# EAGLE schematic SupergunBasic (EAGLE 9.4.0)
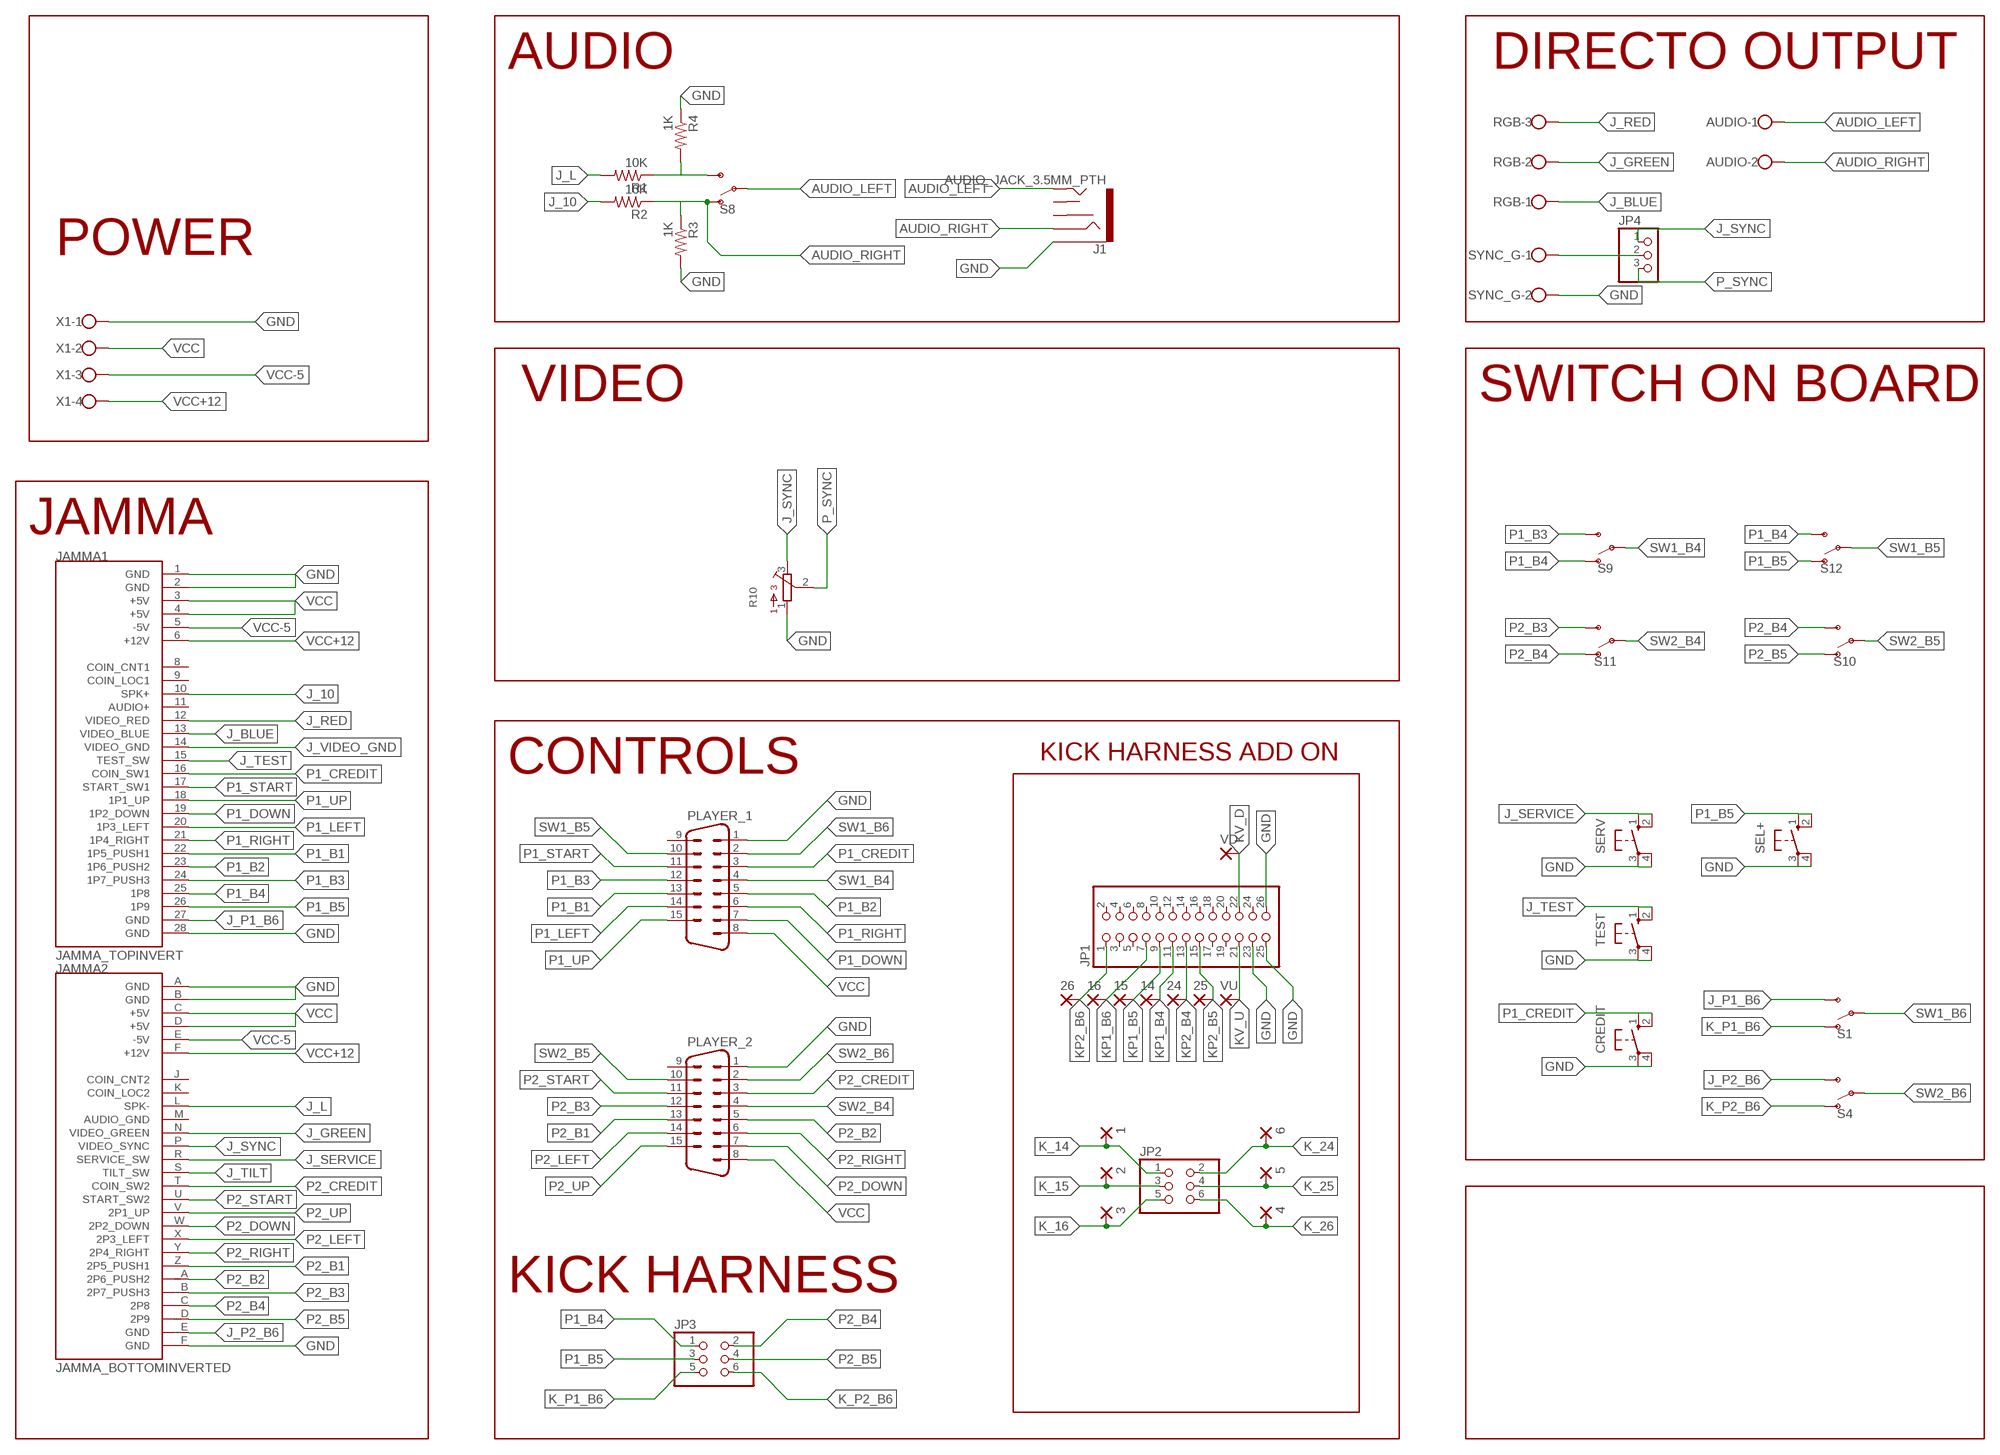
[diagram p0: schematic, sheet 1]

## Parts
1  SMD2  [SMD1,27-2,54]
2  SMD2  [SMD1,27-2,54]
3  SMD2  [SMD1,27-2,54]
4  SMD2  [SMD1,27-2,54]
5  SMD2  [SMD1,27-2,54]
6  SMD2  [SMD1,27-2,54]
14  SMD2  [SMD1,27-2,54]
15  SMD2  [SMD1,27-2,54]
16  SMD2  [SMD1,27-2,54]
24  SMD2  [SMD1,27-2,54]
25  SMD2  [SMD1,27-2,54]
26  SMD2  [SMD1,27-2,54]
AUDIO  W237-102  [W237-102]
CREDIT  10-XX  [B3F-10XX]
J1  AUDIO_JACK_3.5MM_PTH  [AUDIO-JACK]
JAMMA1  JAMMA_TOPINVERT  [JAMMA_TOP_INV]
JAMMA2  JAMMA_BOTTOMINVERTED  [JAMMA_BOTTOM_INV]
JP1  PINHD-2X13  [2X13]
JP2  PINHD-2X3  [2X03]
JP3  PINHD-2X3  [2X03]
JP4  PINHD-1X3  [1X03]
PLAYER_1  M15HP  [M15HP]
PLAYER_2  M15HP  [M15HP]
R1  10K  R-US_0204/7  [0204/7]
R2  10K  R-US_0204/7  [0204/7]
R3  1K  R-US_0204/7  [0204/7]
R4  1K  R-US_0204/7  [0204/7]
R10  3362P  [3362P]
RGB  W237-103  [W237-103]
S1  SWITCH-SPDT-PTH-11.6X4.0MM  [SWITCH_SPDT_PTH_11.6X4.0MM]
S4  SWITCH-SPDT-PTH-11.6X4.0MM  [SWITCH_SPDT_PTH_11.6X4.0MM]
S8  SWITCH-SPDT-PTH-11.6X4.0MM  [SWITCH_SPDT_PTH_11.6X4.0MM]
S9  SWITCH-SPDT-PTH-11.6X4.0MM  [SWITCH_SPDT_PTH_11.6X4.0MM]
S10  SWITCH-SPDT-PTH-11.6X4.0MM  [SWITCH_SPDT_PTH_11.6X4.0MM]
S11  SWITCH-SPDT-PTH-11.6X4.0MM  [SWITCH_SPDT_PTH_11.6X4.0MM]
S12  SWITCH-SPDT-PTH-11.6X4.0MM  [SWITCH_SPDT_PTH_11.6X4.0MM]
SEL+  10-XX  [B3F-10XX]
SERV  10-XX  [B3F-10XX]
SYNC_G  W237-102  [W237-102]
TEST  10-XX  [B3F-10XX]
VD  SMD2  [SMD1,27-2,54]
VU  SMD2  [SMD1,27-2,54]
X1  W237-4  [W237-4]

## Nets
AUDIO_LEFT: AUDIO.1 J1.TIP S8.2(P)
AUDIO_RIGHT: AUDIO.2 J1.RING R2.1 R3.1 S8.1(O)
DIRECT_SYNC: JP4.2 SYNC_G.1
GND [GND]: CREDIT.3(P) CREDIT.4(P1) J1.SLEEVE JAMMA1.1(GND) JAMMA1.2(GND) JAMMA1.28(GND) JAMMA2._F(GND) JAMMA2.A(GND) JAMMA2.B(GND) JP1.23 JP1.25 JP1.26 PLAYER_1.1 PLAYER_2.1 R3.2 R4.1 R10.1 SEL+.3(P) SEL+.4(P1) SERV.3(P) SERV.4(P1) SYNC_G.2 TEST.3(P) TEST.4(P1) X1.1
J_10: JAMMA1.10(SPK+) R2.2
J_BLUE: JAMMA1.13(VIDEO_BLUE) RGB.1
J_GREEN: JAMMA2.N(VIDEO_GREEN) RGB.2
J_L: JAMMA2.L(SPK-) R1.2
J_P1_B6: JAMMA1.27(GND) S1.3(S)
J_P2_B6: JAMMA2._E(GND) S4.3(S)
J_RED: JAMMA1.12(VIDEO_RED) RGB.3
J_SERVICE: JAMMA2.R(SERVICE_SW) SERV.1(S) SERV.2(S1)
J_SYNC: JAMMA2.P(VIDEO_SYNC) JP4.1 R10.3
J_TEST: JAMMA1.15(TEST_SW) TEST.1(S) TEST.2(S1)
J_TILT: JAMMA2.S(TILT_SW)
J_VIDEO_GND [GND]: JAMMA1.14(VIDEO_GND)
K_14: 1.1(P) JP2.1
K_15: 2.1(P) JP2.3
K_16: 3.1(P) JP2.5
K_24: 6.1(P) JP2.2
K_25: 5.1(P) JP2.4
K_26: 4.1(P) JP2.6
K_P1_B6: JP3.5 S1.1(O)
K_P2_B6: JP3.6 S4.1(O)
KP1_B4: 14.1(P) JP1.11
KP1_B5: 15.1(P) JP1.9
KP1_B6: 16.1(P) JP1.7
KP2_B4: 24.1(P) JP1.13
KP2_B5: 25.1(P) JP1.15
KP2_B6: 26.1(P) JP1.1
KV_D: JP1.22 VD.1(P)
KV_U: JP1.21 VU.1(P)
P1_B1: JAMMA1.22(1P5_PUSH1) PLAYER_1.13
P1_B2: JAMMA1.23(1P6_PUSH2) PLAYER_1.5
P1_B3: JAMMA1.24(1P7_PUSH3) PLAYER_1.12 S9.3(S)
P1_B4: JAMMA1.25(1P8) JP3.1 S9.1(O) S12.3(S)
P1_B5: JAMMA1.26(1P9) JP3.3 S12.1(O) SEL+.1(S) SEL+.2(S1)
P1_CREDIT: CREDIT.1(S) CREDIT.2(S1) JAMMA1.16(COIN_SW1) PLAYER_1.3
P1_DOWN: JAMMA1.19(1P2_DOWN) PLAYER_1.7
P1_LEFT: JAMMA1.20(1P3_LEFT) PLAYER_1.14
P1_RIGHT: JAMMA1.21(1P4_RIGHT) PLAYER_1.6
P1_START: JAMMA1.17(START_SW1) PLAYER_1.11
P1_UP: JAMMA1.18(1P1_UP) PLAYER_1.15
P2_B1: JAMMA2.Z(2P5_PUSH1) PLAYER_2.13
P2_B2: JAMMA2._A(2P6_PUSH2) PLAYER_2.5
P2_B3: JAMMA2._B(2P7_PUSH3) PLAYER_2.12 S11.3(S)
P2_B4: JAMMA2._C(2P8) JP3.2 S10.3(S) S11.1(O)
P2_B5: JAMMA2._D(2P9) JP3.4 S10.1(O)
P2_CREDIT: JAMMA2.T(COIN_SW2) PLAYER_2.3
P2_DOWN: JAMMA2.W(2P2_DOWN) PLAYER_2.7
P2_LEFT: JAMMA2.X(2P3_LEFT) PLAYER_2.14
P2_RIGHT: JAMMA2.Y(2P4_RIGHT) PLAYER_2.6
P2_START: JAMMA2.U(START_SW2) PLAYER_2.11
P2_UP: JAMMA2.V(2P1_UP) PLAYER_2.15
P_SYNC: JP4.3 R10.2
STR_LEFT: R1.1 R4.2 S8.3(S)
SW1_B4: PLAYER_1.4 S9.2(P)
SW1_B5: PLAYER_1.10 S12.2(P)
SW1_B6: PLAYER_1.2 S1.2(P)
SW2_B4: PLAYER_2.4 S11.2(P)
SW2_B5: PLAYER_2.10 S10.2(P)
SW2_B6: PLAYER_2.2 S4.2(P)
VCC [VCC]: JAMMA1.3(+5V) JAMMA1.4(+5V) JAMMA2.C(+5V) JAMMA2.D(+5V) PLAYER_1.8 PLAYER_2.8 X1.2
VCC+12 [VCC+12]: JAMMA1.6(+12V) JAMMA2.F(+12V) X1.4
VCC-5 [VCC-5]: JAMMA1.5(-5V) JAMMA2.E(-5V) X1.3
Unconnected: J1.RSH J1.TSH JAMMA1.8(COIN_CNT1) JAMMA1.9(COIN_LOC1) JAMMA1.11(AUDIO+) JAMMA2.J(COIN_CNT2) JAMMA2.K(COIN_LOC2) JAMMA2.M(AUDIO_GND) JP1.2 JP1.3 JP1.4 JP1.5 JP1.6 JP1.8 JP1.10 JP1.12 JP1.14 JP1.16 JP1.17 JP1.18 JP1.19 JP1.20 JP1.24 PLAYER_1.9 PLAYER_2.9

## Notes on the sheet
- AUDIO | DIRECTO OUTPUT
- POWER
- VIDEO | SWITCH ON BOARD
- JAMMA
- KICK HARNESS ADD ON
- CONTROLS
- KICK HARNESS

## Library data of the parts
1-6 14-16 24-26 VD VU = wirepad:SMD2: SMD PAD
AUDIO SYNC_G = con-wago-500:W237-102: WAGO SCREW CLAMP; MPN: 237-102; OC_FARNELL: unknown; OC_NEWARK: 70K9898
CREDIT SEL+ SERV TEST = switch-omron:10-XX: OMRON SWITCH; MPN: B3F-1000; OC_FARNELL: 176432; OC_NEWARK: 36M3542
J1 = SparkFun-Connectors:AUDIO_JACK_3.5MM: Audio Jack 3.5mm variants of PTH and SMT stereo audio jack with bypass switches. SparkFun Products: SparkFun SparkPunk Sound Kit <[https://www.sparkfun.com/products/11177]> - PTH MP3 Trigger <https://www.sparkfun.com/products/13720> -3.5mm SMD SparkFun PicoBoard <https://www.sparkfun.com/products/11888>- 2.5mm SMD; PROD_ID: CONN-08774; SF_ID: PRT-08032
JAMMA1 = JAMMA_2:JAMMA_TOP: JAMMA Connector Top Parts side for these card-edge connenctors HIROSE CR7E-56DA-3.96E HIROSE CR7E-56DB-3.96E KEL 1168-056-009
JAMMA2 = JAMMA_2:JAMMA_BOTTOM: JAMMA Connector Bottom Solder side for these card-edge connenctors HIROSE CR7E-56DA-3.96E HIROSE CR7E-56DB-3.96E KEL 1168-056-009
JP1 = pinhead:PINHD-2X13: PIN HEADER
JP2 JP3 = pinhead:PINHD-2X3: PIN HEADER
JP4 = pinhead:PINHD-1X3: PIN HEADER
PLAYER_1 PLAYER_2 = con-subd:M15: SUB-D; OC_FARNELL: unknown; OC_NEWARK: unknown
R1-R4 = adafruit:R-US_: RESISTOR, American symbol
R10 = bourns:3362: 3362 Series 1/4" Square Trimmer
RGB = con-wago-500:W237-103: WAGO SCREW CLAMP; MPN: 237-103; OC_FARNELL: unknown; OC_NEWARK: 18M7116
S1 S4 S8-S12 = SparkFun-Switches:SWITCH-SPDT: Single Pole, Double Throw (SPDT) Switch Single-pole, double-throw (SPDT) switch. Variant Overview SMD-AYZ0202 Surface Mount DPDT Switch <https://www.sparkfun.com/products/597> (COM-00597) Used on e.g. LilyPad Arduino USB - ATmega32U4 Board <https://www.sparkfun.com/products/12049> PTH-11.6X4.0MM SPDT Mini Power Switch <https://www.sparkfun.com/products/102> (COM-00102) Used on e.g. SparkFun Simon Says - Through-Hole Soldering Kit <https://www.sparkfun.com/products/10547> (KIT-10547) PTH-11.6X4.0MM-KIT KIT version of SPDT Mini Power Switch - Simplifies soldering by removing tStop of switch pins - only one side can be soldered. PTH-11.6X4.0MM-LOCK LOCK version of SPDT Mini Power Switch - Offset pins hold switch in place for easier soldering. SMD-RIGHT-ANGLE Surface Mount Right Angle Switch <https://www.sparkfun.com/products/10860> (COM-10860) Used on e.g. SparkFun ESP8266 Thing <https://www.sparkfun.com/products/13231>; PROD_ID: SWCH-08261; SF_SKU: COM-00102
X1 = con-wago-500:W237-4: WAGO SCREW CLAMP; OC_FARNELL: unknown; OC_NEWARK: unknown

## Net classes
0 Default: width 0.152 mm
1 VCC: width 0.762 mm
2 VCC-5: width 0.762 mm
3 VCC+12: width 2.032 mm
4 GND: width 0.762 mm